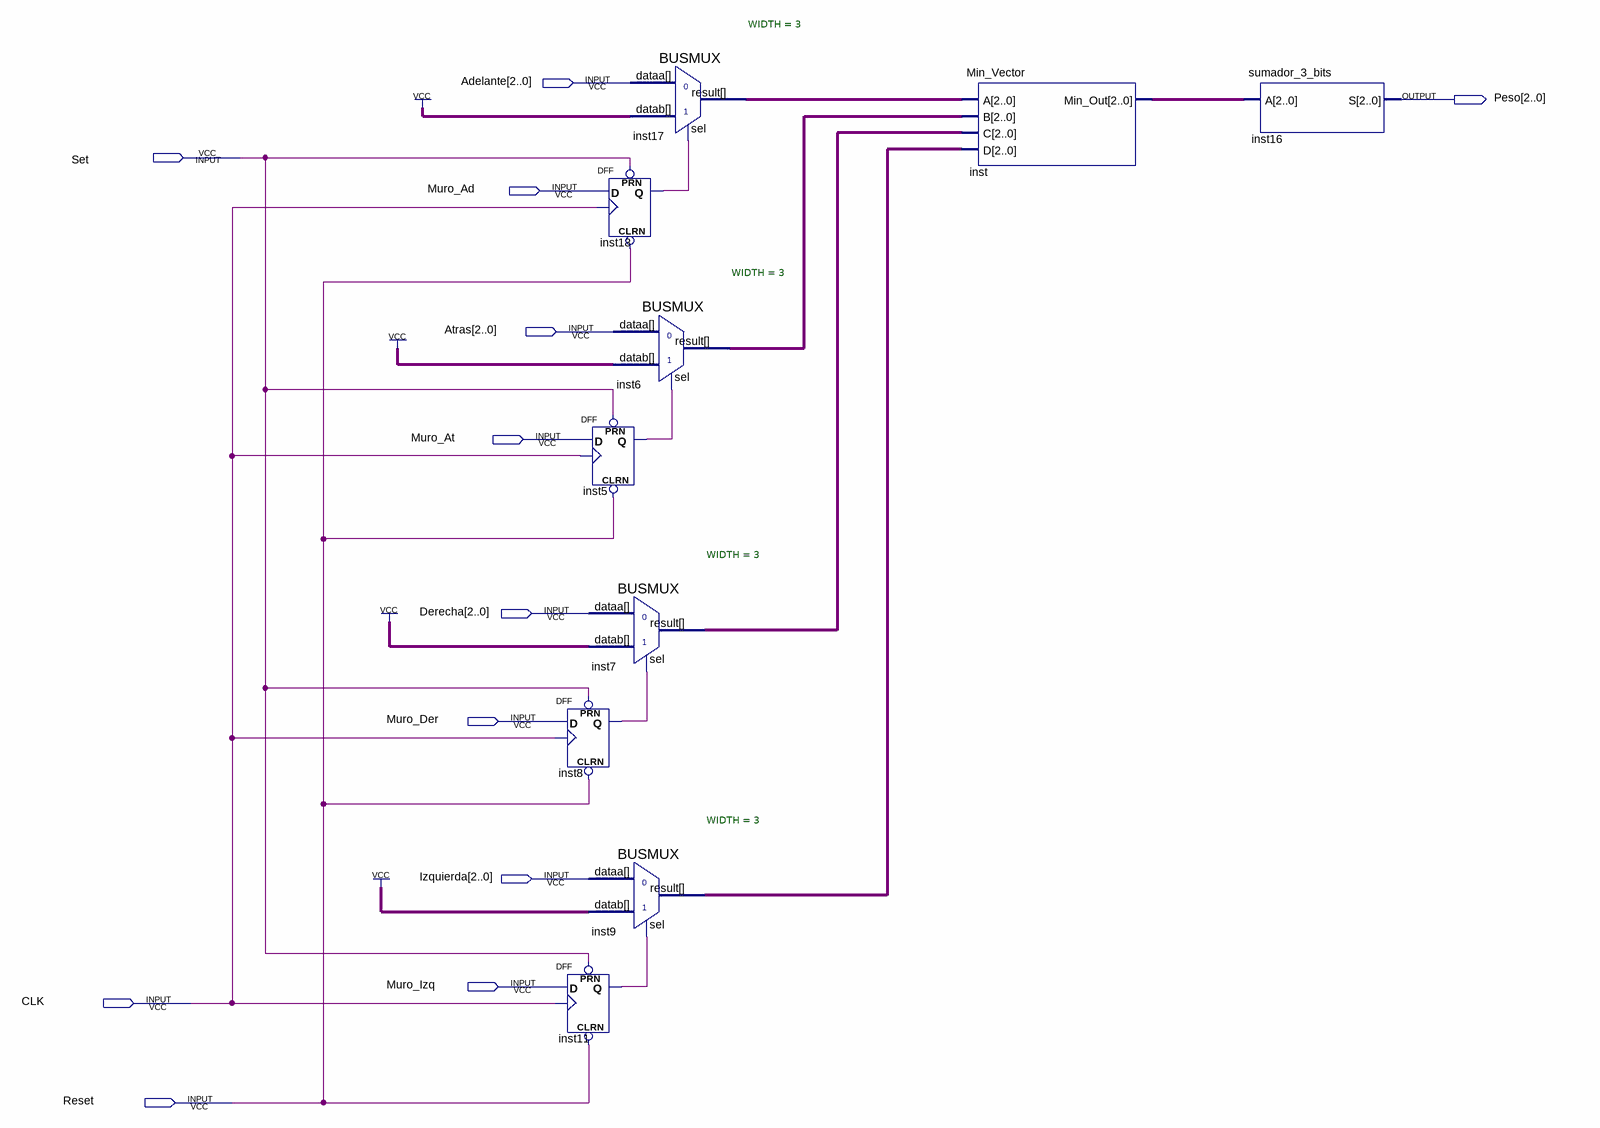
[diagram p0: schematic sheet]
// Quartus schematic Celda.bdf as structural Verilog: 10 symbols, 12 pins
module Celda (
  input  [2:0] Adelante,
  input  Set,
  input  Muro_Ad,
  input  [2:0] Atras,
  input  Muro_At,
  input  [2:0] Derecha,
  input  Muro_Der,
  input  [2:0] Izquierda,
  input  Muro_Izq,
  input  CLK,
  input  Reset,
  output [2:0] Peso
);

  wire inst5_q, inst8_q, inst11_q, inst18_q;
  wire [2:0] inst6_result, inst7_result, inst9_result, inst17_result, inst_min_out;

  DFF inst18 (.CLRN(Reset), .CLK(CLK), .D(Muro_Ad), .PRN(Set), .Q(inst18_q));
  DFF inst5 (.CLRN(Reset), .CLK(CLK), .D(Muro_At), .PRN(Set), .Q(inst5_q));
  BUSMUX #(.WIDTH(3)) inst7 (.datab(3'b111), .sel(inst8_q), .dataa(Derecha), .result(inst7_result));
  DFF inst8 (.CLRN(Reset), .CLK(CLK), .D(Muro_Der), .PRN(Set), .Q(inst8_q));
  BUSMUX #(.WIDTH(3)) inst9 (.datab(3'b111), .sel(inst11_q), .dataa(Izquierda), .result(inst9_result));
  DFF inst11 (.CLRN(Reset), .CLK(CLK), .D(Muro_Izq), .PRN(Set), .Q(inst11_q));
  BUSMUX #(.WIDTH(3)) inst17 (.datab(3'b111), .sel(inst18_q), .dataa(Adelante), .result(inst17_result));
  BUSMUX #(.WIDTH(3)) inst6 (.datab(3'b111), .sel(inst5_q), .dataa(Atras), .result(inst6_result));
  Min_Vector inst (.A(inst17_result), .B(inst6_result), .C(inst7_result), .D(inst9_result), .Min_Out(inst_min_out));
  sumador_3_bits inst16 (.A(inst_min_out), .S(Peso));
endmodule
